# Altium schematic sheet power_supplies.SchDoc: Supplies
size A3; DocumentNumber: 1; SheetNumber: 4; SheetTotal: 4
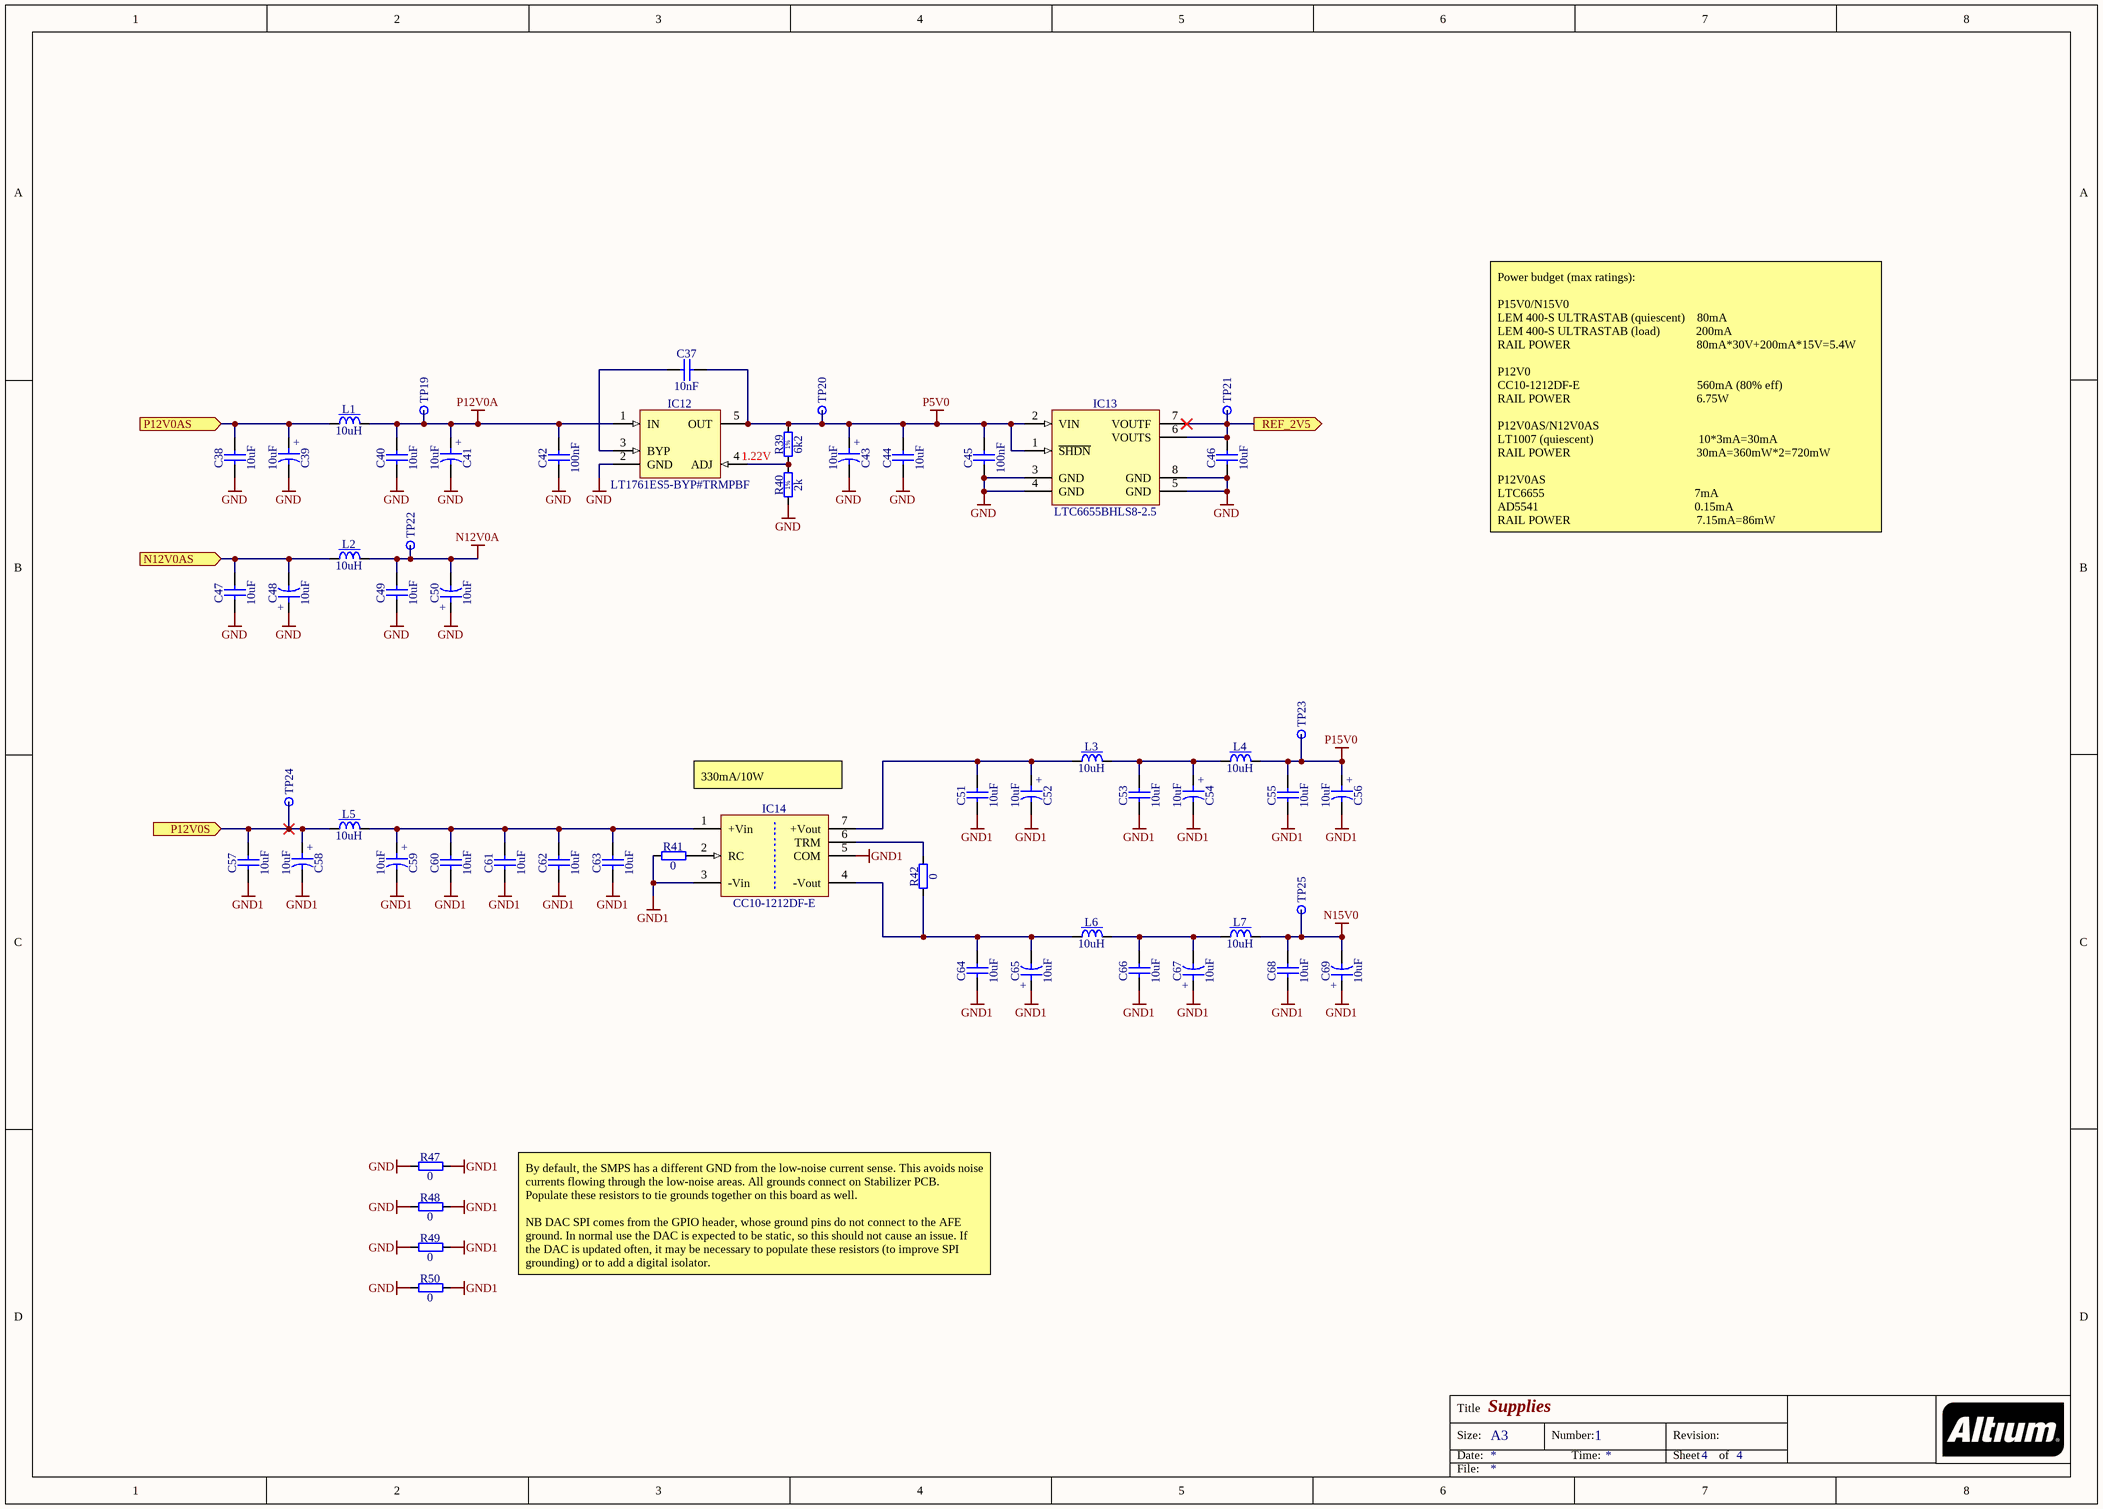
[diagram p0: power_supplies.SchDoc]

## Parts
C37  10nF  [CAPC1608X87N]
C38  10uF  [CAPC2012X95N]
C39  10uF  [CAPMP6032X280N]
C40  10uF  [CAPC2012X95N]
C41  10uF  [CAPMP6032X280N]
C42  100nF  [CAPC1608X87N]
C43  10uF  [CAPMP6032X280N]
C44  10uF  [CAPC2012X95N]
C45  100nF  [CAPC1608X87N]
C46  10uF  [CAPC2012X95N]
C47  10uF  [CAPC2012X95N]
C48  10uF  [CAPMP6032X280N]
C49  10uF  [CAPC2012X95N]
C50  10uF  [CAPMP6032X280N]
C51  10uF  [CAPC2012X95N]
C52  10uF  [CAPMP6032X280N]
C53  10uF  [CAPC2012X95N]
C54  10uF  [CAPMP6032X280N]
C55  10uF  [CAPC2012X95N]
C56  10uF  [CAPMP6032X280N]
C57  10uF  [CAPC2012X95N]
C58  10uF  [CAPMP6032X280N]
C59  10uF  [CAPMP6032X280N]
C60  10uF  [CAPC2012X95N]
C61  10uF  [CAPC2012X95N]
C62  10uF  [CAPC2012X95N]
C63  10uF  [CAPC2012X95N]
C64  10uF  [CAPC2012X95N]
C65  10uF  [CAPMP6032X280N]
C66  10uF  [CAPC2012X95N]
C67  10uF  [CAPMP6032X280N]
C68  10uF  [CAPC2012X95N]
C69  10uF  [CAPMP6032X280N]
IC12  LT1761ES5-BYP#TRMPBF  [SOT95P280X100-5N]
IC13  LTC6655BHLS8-2.5  [LT_LS8]
IC14  CC10-1212DF-E  [CC10-1212DF-E]
L1  10uH  [IND_MURATA-PS_8400]
L2  10uH  [IND_MURATA-PS_8400]
L3  10uH  [IND_MURATA-PS_8400]
L4  10uH  [IND_MURATA-PS_8400]
L5  10uH  [IND_MURATA-PS_8400]
L6  10uH  [IND_MURATA-PS_8400]
L7  10uH  [IND_MURATA-PS_8400]
R39  6k2  [RESC1608X55N]
R40  2k  [RESC1608X55N]
R41  0  [RESC1608X55N]
R42  0  [RESC1608X55N]
R47  0  [RESC1608X55N]
R48  0  [RESC1608X55N]
R49  0  [RESC1608X55N]
R50  0  [RESC1608X55N]
TP19  Test Point  [TPS127]  (value not drawn)
TP20  Test Point  [TPS127]  (value not drawn)
TP21  Test Point  [TPS127]  (value not drawn)
TP22  Test Point  [TPS127]  (value not drawn)
TP23  Test Point  [TPS127]  (value not drawn)
TP24  Test Point  [TPS127]  (value not drawn)
TP25  Test Point  [TPS127]  (value not drawn)

## Ports
N12V0AS (in), P12V0AS (in), P12V0S (in), REF_2V5 (out)

## Nets
GND: C38.1 C39.2 C40.1 C41.2 C42.1 C43.2 C44.1 C45.1 C46.1 C47.1 C48.1 C49.1 C50.1 IC12.2(GND) IC13.3(GND) IC13.4(GND) IC13.5(GND) IC13.8(GND) R40.1 R47.1 R48.1 R49.1 R50.1
GND1: C51.1 C52.2 C53.1 C54.2 C55.1 C56.2 C57.1 C58.2 C59.2 C60.1 C61.1 C62.1 C63.1 C64.1 C65.1 C66.1 C67.1 C68.1 C69.1 IC14.3(-Vin) IC14.5(COM) R41.1 R47.2 R48.2 R49.2 R50.2
N12V0A: C49.2 C50.2 L2.2 TP22.1
N15V0: C68.2 C69.2 L7.2 TP25.1
P5V0: C37.2 C43.1 C44.2 C45.2 IC12.5(OUT) IC13.1(~{SHDN}) IC13.2(VIN) R39.2 TP20.1
P12V0A: C40.2 C41.1 C42.2 IC12.1(IN) L1.2 TP19.1
P15V0: C55.2 C56.1 L4.2 TP23.1
N12V0AS: C47.2 C48.2 L2.1 ; port N12V0AS
P12V0AS: C38.2 C39.1 L1.1 ; port P12V0AS
P12V0S: C57.2 C58.1 L5.1 TP24.1 ; port P12V0S
REF_2V5: C46.2 IC13.6(VOUTS) IC13.7(VOUTF) TP21.1 ; port REF_2V5
NetC37_1: C37.1 IC12.3(BYP)
NetC51_2: C51.2 C52.1 IC14.7(+Vout) L3.1
NetC53_2: C53.2 C54.1 L3.2 L4.1
NetC59_1: C59.1 C60.2 C61.2 C62.2 C63.2 IC14.1(+Vin) L5.2
NetC64_2: C64.2 C65.2 IC14.4(-Vout) L6.1 R42.1
NetC66_2: C66.2 C67.2 L6.2 L7.1
NetIC12_4: IC12.4(ADJ) R39.1 R40.2
NetIC14_2: IC14.2(RC) R41.2
NetIC14_6: IC14.6(TRM) R42.2

## Notes on the sheet
- 1.22V
- Power budget (max ratings):
  P15V0/N15V0
  LEM 400-S ULTRASTAB (quiescent)    80mA
  LEM 400-S ULTRASTAB (load)            200mA
  RAIL POWER                                          80mA*30V+200mA*15V=5.4W
  P12V0
  CC10-1212DF-E                                       560mA (80% eff)
  RAIL POWER                                          6.75W
  P12V0AS/N12V0AS
  LT1007 (quiescent)                                   10*3mA=30mA
  RAIL POWER                                          30mA=360mW*2=720mW
  P12V0AS
  LTC6655                                                  7mA
  AD5541                                                    0.15mA
  RAIL POWER                                          7.15mA=86mW
- (near IC14) 330mA/10W
- By default, the SMPS has a different GND from the low-noise current sense. This avoids noise currents flowing through the low-noise areas. All grounds connect on Stabilizer PCB. Populate these resistors to tie grounds together on this board as well.
  NB DAC SPI comes from the GPIO header, whose ground pins do not connect to the AFE ground. In normal use the DAC is expected to be static, so this should not cause an issue. If the DAC is updated often, it may be necessary to populate these resistors (to improve SPI grounding) or to add a digital isolator.
- Title
- Size:
- Date:
- A3
- Number:
- Time:
- Revision:
- Sheet
- of
- File:
- (in symbol CTE6032-28_10UF_25V_10%_LESR0500) +
- (in symbol R0603_2K_1%_0.1W_100PPM) 1%
- (in symbol R0603_6K2_1%_0.1W_100PPM) 1%

## Library data of the parts
C37 = CC0603_10NF_50V_10%_X7R: Non-polarised capacitor; Part Description: SMD Multilayer Chip Ceramic Capacitor; Manufacturer: GENERIC; Manufacturer1 Part Number: 223858615636; Voltage: 50V; TC: X7R; Tolerance: ±10%; Part Number: CC0603_10NF_50V_10%_X7R; Component Kind: Standard; Component Type: Standard; Pin Count: 2; Value: 10nF; Status: Preferred; Manufacturer Part Number: CC0603_10NF_50V_10%_X7R; Case: 0603; Mounted: Yes; Socket: No; SMD: Yes; Sense: No; Manufacturer1 Example: PHYCOMP; Manufacturer1 ComponentHeight: 0.87mm; HelpURL: \\cern.ch\dfs\Applications\Altium\Datasheets\CC0603_X7R_PHYCOMP.pdf; Author: CERN DEM JLC; CreateDate: 03/12/2007; LatestRevisionDate: 03/12/2007
C38 C40 C44 C46 C47 C49 C51 C53 C55 C57 C60-C64 C66 C68 = CC0805_10UF_25V_10%_X5R: Non-polarised capacitor; Part Description: SMD Multilayer Chip Ceramic Capacitor; Manufacturer: GENERIC; Manufacturer1 Part Number: GRM219R61E106KA12D; Voltage: 25V; TC: X5R; Tolerance: ±10%; Part Number: CC0805_10UF_25V_10%_X5R; Component Kind: Standard; Component Type: Standard; Pin Count: 2; Value: 10uF; Status: Preferred; Manufacturer Part Number: CC0805_10UF_25V_10%_X5R; Case: 0805; Mounted: Yes; Socket: No; SMD: Yes; Sense: No; Manufacturer1 Example: MURATA; Manufacturer1 ComponentHeight: 0.95mm; HelpURL: \\cern.ch\dfs\Applications\Altium\Datasheets\CC0805_X5R_MURATA_GRM.pdf; Author: CERN DEM JLC; CreateDate: 25/10/2012; LatestRevisionDate: 06/09/2016
C39 C41 C43 C48 C50 C52 C54 C56 C58 C59 C65 C67 C69 = CTE6032-28_10UF_25V_10%_LESR0500: Polarised capacitor; Part Description: Low ESR 0R5 Solid Tantalum Chip Capacitor; Manufacturer: GENERIC; Manufacturer1 Part Number: TPSC106K025R0500; Voltage: 25V; Tolerance: ±10%; Part Number: CTE6032-28_10UF_25V_10%_LESR0500; Component Kind: Standard; Component Type: Standard; Pin Count: 2; Value: 10uF; Status: Preferred; Manufacturer Part Number: CTE6032-28_10UF_25V_10%_LESR0500; Case: C; Mounted: Yes; Socket: No; SMD: Yes; Sense: No; Manufacturer1 Example: AVX; Manufacturer1 ComponentHeight: 2.8mm; HelpURL: \\cern.ch\dfs\Applications\Altium\Datasheets\CTE-LESR_AVX_TPS.pdf; Author: CERN DEM JLC; CreateDate: 05/05/2008; LatestRevisionDate: 20/01/2009
C42 C45 = CC0603_100NF_50V_10%_X7R: Non-polarised capacitor; Part Description: SMD Multilayer Chip Ceramic Capacitor; Manufacturer: GENERIC; Manufacturer1 Part Number: 223858615649; Voltage: 50V; TC: X7R; Tolerance: ±10%; Part Number: CC0603_100NF_50V_10%_X7R; Component Kind: Standard; Component Type: Standard; Pin Count: 2; Value: 100nF; Status: Preferred; Manufacturer Part Number: CC0603_100NF_50V_10%_X7R; Case: 0603; Mounted: Yes; Socket: No; SMD: Yes; Sense: No; Manufacturer1 Example: PHYCOMP; Manufacturer1 ComponentHeight: 0.87mm; HelpURL: \\cern.ch\dfs\Applications\Altium\Datasheets\CC0603_X7R_PHYCOMP.pdf; Author: CERN DEM JLC; CreateDate: 03/12/2007; LatestRevisionDate: 03/12/2007
IC12 = LT1761ES5-BYP#TRMPBF: 100mA, Low Noise, LDO Micropower Adjustable Regulator in SOT-23; Part Description: 1.22V to 20V, 100mA, Low Noise, LDO Adjustable Micropower Regulator; Manufacturer: LINEAR TECHNOLOGY; PressFit: No; Bonding: No; Part Number: LT1761ES5-BYP#TRMPBF; Component Kind: Standard; Component Type: Standard; Device: LT1761ES5-BYP#TRMPBF; PackageDescription: SOT23, 0.95mm pitch; 5 pin, 1.6mm W X 2.9mm L, IPC Medium Density; Manufacturer Part Number: LT1761ES5-BYP#TRMPBF; Pin Count: 5; Case: SOT23; Mounted: Yes; Socket: No; SMD: Yes; Sense: No; ComponentHeight: 1mm; HelpURL: \\cern.ch\dfs\Applications\Altium\Datasheets\LT1761ES5-SD#TRMPBF.pdf; Author: CERN DEM MR; CreateDate: 17/02/2016; LatestRevisionDate: 17/02/2016
IC13 = LTC6655BHLS8-2.5#PBF: 2.5V, 0.25ppm Noise, Low Drift Precision Buffered Voltage Reference; Manufacturer: ANALOG DEVICES; Supplier 1: Digi-Key; Manufacturer Part Number: LTC6655BHLS8-2.5#PBF; Device: LTC6655BHLS8-2.5
IC14 = CC10-1212DF-E: CONV DC/DC 10W DUAL 12V +-12V PCB; Manufacturer: TDK-Lambda Americas Inc.; PressFit: No; Bonding: No; Part Number: CC10-1212DF-E; Component Kind: Standard; Component Type: Standard; Device: CC10-1212DF-E; PackageDescription: CC10 Series, Body 1.400 x 0.890 x 0.335, Regulated; Part Description: CONV DC/DC 10W DUAL 12V +-12V PCB; Manufacturer Part Number: CC10-1212DF-E; Pin Count: 7; Mounted: Yes; Socket: No; SMD: No; Sense: No; ComponentHeight: 8.5; Author: TPH; CreateDate: 14.03.2019; LatestRevisionDate: 14.03.2019
L1-L7 = IND_10UH_10%_MURATA-PS_8400: Inductor With Core; Part Description: Miniature Surface Mount Power Inductor (8400 Serie); Manufacturer: MURATA POWER SOLUTIONS; Manufacturer Part Number: 84103C; Power: 950mA; Resistance: 0.24R; Tolerance: ±10%; Part Number: IND_10UH_10%_MURATA-PS_8400; Component Kind: Standard; Component Type: Standard; Pin Count: 2; Value: 10uH; Status: None; Mounted: Yes; Socket: No; SMD: Yes; Sense: No; ComponentHeight: 2.9mm; HelpURL: \\cern.ch\dfs\Applications\Altium\Datasheets\IND_MURATA-PS_8400.pdf; Author: CERN DEM JLC; CreateDate: 02.07.2012; LatestRevisionDate: 02.07.2012
R39 = R0603_6K2_1%_0.1W_100PPM: Resistor - 1%; Part Description: General Purpose Thick Film Chip Resistor; Manufacturer: GENERIC; Manufacturer1 Part Number: NRC06F6201TRF; Power: 0.1W; TC: ±100ppm/°C; PressFit: No; Part Number: R0603_6K2_1%_0.1W_100PPM; Component Kind: Standard; Component Type: Standard; Pin Count: 2; Value: 6k2; Status: Preferred; Tolerance: ±1%; Manufacturer Part Number: R0603_6K2_1%_0.1W_100PPM; Case: 0603; Mounted: Yes; Sense: No; Socket: No; SMD: Yes; Manufacturer1 Example: NIC COMPONENT; Manufacturer1 ComponentHeight: 0.55mm; HelpURL: \\cern.ch\dfs\Applications\Altium\Datasheets\R0603_NIC_NRC.pdf; Author: CERN DEM JLC; CreateDate: 03/12/2007; LatestRevisionDate: 13/03/2008
R40 = R0603_2K_1%_0.1W_100PPM: Resistor - 1%; Part Description: General Purpose Thick Film Chip Resistor; Manufacturer: GENERIC; Manufacturer1 Part Number: NRC06F2001TRF; Power: 0.1W; TC: ±100ppm/°C; PressFit: No; Part Number: R0603_2K_1%_0.1W_100PPM; Component Kind: Standard; Component Type: Standard; Pin Count: 2; Value: 2k; Status: Preferred; Tolerance: ±1%; Manufacturer Part Number: R0603_2K_1%_0.1W_100PPM; Case: 0603; Mounted: Yes; Sense: No; Socket: No; SMD: Yes; Manufacturer1 Example: NIC COMPONENT; Manufacturer1 ComponentHeight: 0.55mm; HelpURL: \\cern.ch\dfs\Applications\Altium\Datasheets\R0603_NIC_NRC.pdf; Author: CERN DEM JLC; CreateDate: 03/12/2007; LatestRevisionDate: 13/03/2008
R41 R42 R47-R50 = R0603_0R_JUMPER: Resistor; Part Description: 1A (0.05R Max DC Resistance) Zero Ohm Jumper; Manufacturer: GENERIC; Manufacturer1 Part Number: NRC06Z0; PressFit: No; Part Number: R0603_0R_JUMPER; Component Kind: Standard; Component Type: Standard; Pin Count: 2; Value: 0; Status: Preferred; Manufacturer Part Number: R0603_0R_JUMPER; Case: 0603; Mounted: Yes; Sense: No; Socket: No; SMD: Yes; Manufacturer1 Example: NIC COMPONENT; Manufacturer1 ComponentHeight: 0.55mm; HelpURL: \\cern.ch\dfs\Applications\Altium\Datasheets\R0603_NIC_NRC.pdf; Author: CERN DEM JLC; CreateDate: 03/12/2007; LatestRevisionDate: 13/03/2008
TP19-TP25 = SMD_PAD_1.27X1.27MM: Part Description: 1.27mm x 1.27mm PCB Copper Area (SMD Test Point); Mounted: No; Part Number: SMD_PAD_1.27X1.27MM; Component Kind: Standard (No BOM); Component Type: Standard (No BOM); Pin Count: 1; Family: Test Point; Socket: No; SMD: Yes; Sense: No; Status: None; ComponentHeight: 0mm; HelpURL: Undefined; Author: CERN DEM JLC; CreateDate: 12/01/2008; LatestRevisionDate: 12/01/2008; PackageDescription: 1.27mm x 1.27mm PCB Copper Area (SMD Test Point)